# EasyEDA schematic easyeda_source.json
TITLE: UV Lamp Timer; REV: 1.0; Date: 2020-12-06; Sheet: 1/1; Drawn By: Alexander Shevchenko
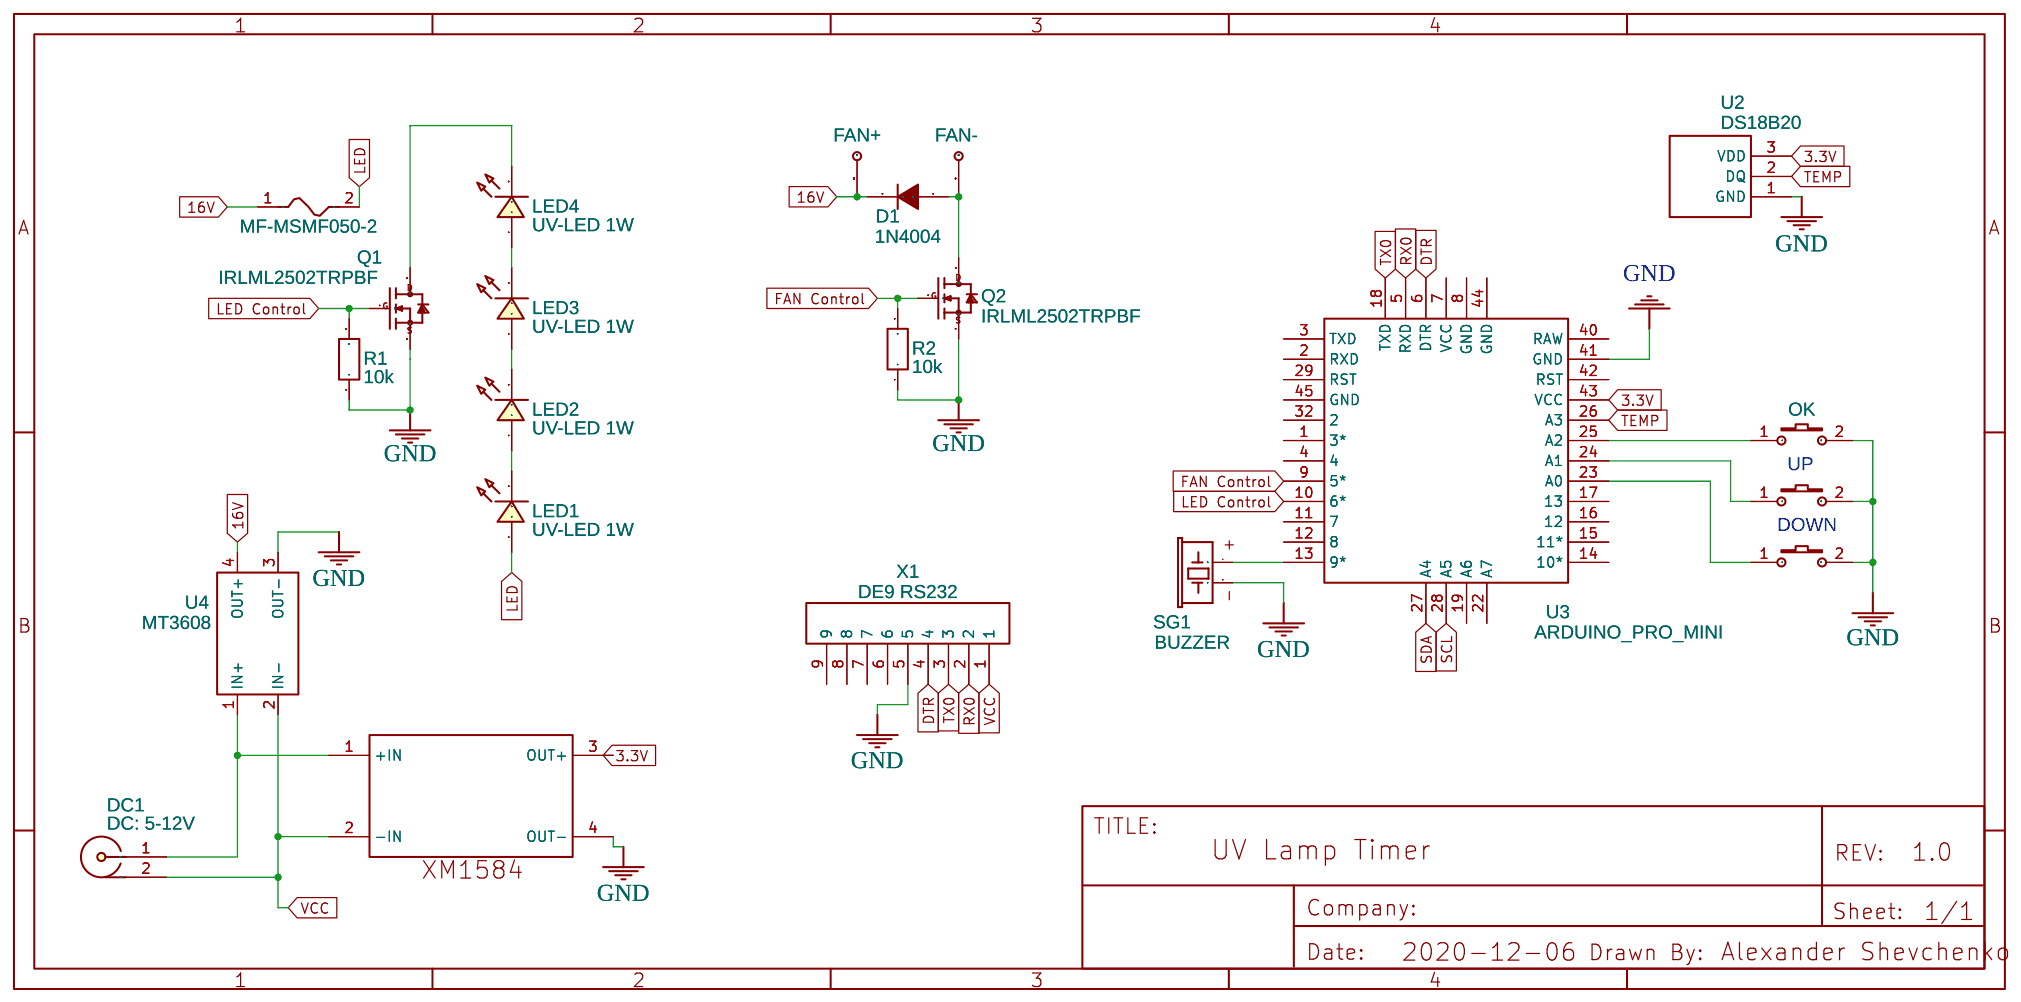
[diagram p0: schematic sheet]

## Parts
D1  1N4004  [DO-41_BD2.4-L4.7-P8.70-D0.9-FD]
DC1  DC: 5-12V  [DC-5020]
DC-DC  XM1584  [XM1584 PSB]
FAN+  Pad  [PAD-100-50-RECT]
FAN-  Pad  [PAD-100-50-RECT]
FUSE1  MF-MSMF050-2  [1812]
KEY1  +  [KEY-SMD_2P-L6.2-W3.6-LS8.0]
KEY5  +  [KEY-SMD_2P-L6.2-W3.6-LS8.0]
KEY6  OK  [KEY-SMD_2P-L6.2-W3.6-LS8.0]
LED1  UV-LED 1W  [LED0603_RED]
LED2  UV-LED 1W  [LED0603_RED]
LED3  UV-LED 1W  [LED0603_RED]
LED4  UV-LED 1W  [LED0603_RED]
Q1  IRLML2502TRPBF  [SEEED-SOT-23]
Q2  IRLML2502TRPBF  [SEEED-SOT-23]
R1  10k  [R0805]
R2  10k  [R0805]
SG1  BUZZER  [BUZZER-12MM-NS-KIT]
U2  DS18B20  [TO-92(TO-92-3)]
U3  ARDUINO_PRO_MINI  [ARDUINO_PRO_MINI]
U4  MT3608  [MT3608 4-BAND MODULE]
X1  DE9 RS232  [RS232_DB9_TO_SIL]

## Library data of the parts
D1 = 1N4004: Supplier: LCSC; Manufacturer: MDD; image: //image.lceda.cn/szlcsc/C3058.jpg; Supplier Part: C3058
DC1 = DC-input: Manufacturer: SOFNG(台湾硕方); Manufacturer Part: DC005-2.0MM; Contributor: Roberto197
DC-DC = XM1584: Mounted: Yes
FAN+ FAN- = Pad: Contributor: David Marcos Guerrero
FUSE1 = FUSE MF-MSMF050-2: Supplier: LCSC; Manufacturer: BOURNS; Supplier Part: C17313
KEY1 KEY5 KEY6 = K2-3.6×6.1_SMD: Supplier Part: C118141; Supplier: LCSC; Manufacturer Part: K2-1107ST-A4SW-06; Contributor: LCEDA_Lib; 制造商: 韩国韩荣
LED1-LED4 = LED-0603_R: Manufacturer: EVERLIGHT(台湾亿光); Manufacturer Part: 19-217/R6C-AL1M2VY/3T; Supplier Part: C72044; Supplier: LCSC; Contributor: LCEDA_01
Q1 Q2 = IRLML2502TRPBF: sourceId: rf9qkCUO6; Supplier Part: 305030022; Supplier: SeeedStudio
R1 R2 = R_0201_EU: Contributor: LCEDA_Lib
SG1 = BUZZER: Contributor: kantanat stamp
U2 = DS18B20: Supplier Part: C9753; Supplier: LCSC; Manufacturer: MAXIM; Manufacturer Part: DS18B20+; image: //image.lceda.cn/szlcsc/C9753.jpg
U3 = ARDUINO_PRO_MINI: Contributor: Dimak
U4 = MT3608 4-band module: Contributor: kudato
X1 = DE9_TO_SIL_RS232: Contributor: milliwatt

## Nets
3.3V: DC-DC.3(OUT+) U2.3(VDD) U3.43(VCC)
16V: D1.2(K) FAN+.P$1 FUSE1.1 U4.4(OUT+)
GND: DC-DC.4(OUT-) KEY1.2 KEY5.2 KEY6.2 Q1.2(S) Q2.2(S) R1.1 R2.1 SG1.+(1) U2.1(GND) U3.41(GND) U4.3(OUT-) X1.5
VCC: DC1.2 DC-DC.2(-IN) U4.2(IN-) X1.1
DTR: U3.6(DTR) X1.4
FAN Control: Q2.1(G) R2.2 U3.9(5*)
LED: FUSE1.2 LED1.1
LED Control: Q1.1(G) R1.2 U3.10(6*)
RX0: U3.5(RXD) X1.2
SCL: U3.28(A5)
SDA: U3.27(A4)
TEMP: U2.2(DQ) U3.26(A3)
TX0: U3.18(TXD) X1.3
Net-(D1-1): D1.1(A) FAN-.P$1 Q2.3(D)
Net-(DC1-1): DC1.1(VCC) DC-DC.1(+IN) U4.1(IN+)
Net-(KEY1-1): KEY1.1 U3.24(A1)
Net-(KEY5-1): KEY5.1 U3.23(A0)
Net-(KEY6-1): KEY6.1 U3.25(A2)
Net-(LED1-2): LED1.2 LED2.1
Net-(LED2-2): LED2.2 LED3.1
Net-(LED3-2): LED3.2 LED4.1
Net-(LED4-2): LED4.2 Q1.3(D)
Net-(SG1--): SG1.-(2) U3.13(9*)

Not connected (* = marked no-connect by the designer): U3 1(3*) 2(RXD) 3(TXD) 4 7(VCC) 8(GND) 11(7) 12(8) 14(10*) 15(11*) 16(12) 17(13) 19(A6) 22(A7) 29(RST) 32(2) 40(RAW) 42(RST) 44(GND) 45(GND); X1 6 7 8 9

## Notes on the sheet
- UP
- DOWN
